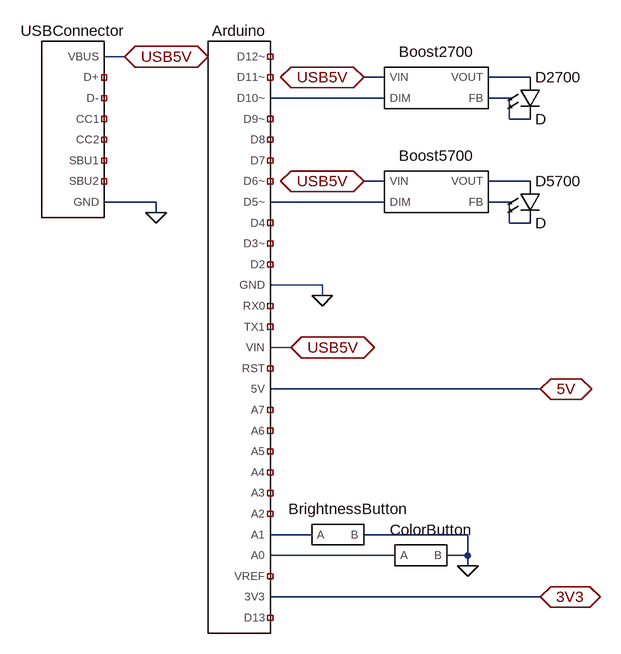
[diagram p0: schematic LEDs.asc]
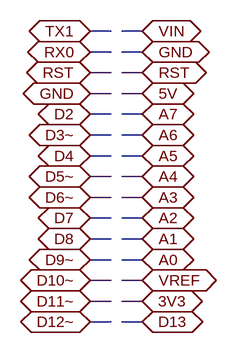
[diagram p1: sub-circuit arduino.asc]
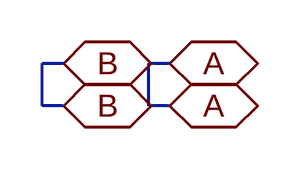
[diagram p2: sub-circuit button.asc]
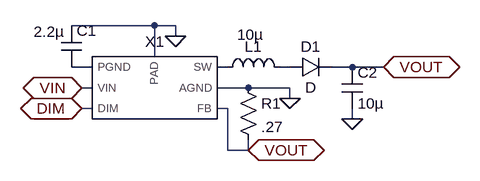
[diagram p3: sub-circuit boost.asc]
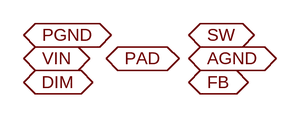
[diagram p4: sub-circuit boostcontroller.asc]
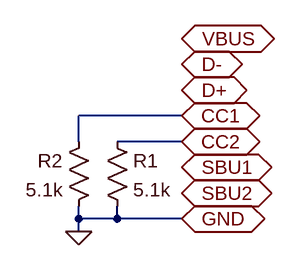
[diagram p5: sub-circuit usbc.asc]
LEDs.asc, the LTspice schematic file:
Version 4
SHEET 1 1184 824
WIRE -192 -112 -224 -112
WIRE 208 -80 176 -80
WIRE 432 -80 368 -80
WIRE 208 -48 32 -48
WIRE 400 -48 368 -48
WIRE 400 -16 400 -48
WIRE 432 -16 400 -16
WIRE 208 80 176 80
WIRE 432 80 368 80
WIRE -144 112 -224 112
WIRE 208 112 32 112
WIRE 400 112 368 112
WIRE -144 128 -144 112
WIRE 400 144 400 112
WIRE 432 144 400 144
WIRE 112 240 32 240
WIRE 112 256 112 240
WIRE 64 336 32 336
WIRE 448 400 32 400
WIRE 96 624 32 624
WIRE 336 624 176 624
WIRE 224 656 32 656
WIRE 336 656 336 624
WIRE 336 656 304 656
WIRE 336 672 336 656
WIRE 448 720 32 720
FLAG 336 672 0
FLAG 112 256 0
FLAG 448 720 3V3
IOPIN 448 720 BiDir
FLAG 448 400 5V
IOPIN 448 400 BiDir
FLAG 176 -80 USB5V
IOPIN 176 -80 BiDir
FLAG 176 80 USB5V
IOPIN 176 80 BiDir
FLAG 64 336 USB5V
IOPIN 64 336 BiDir
FLAG -192 -112 USB5V
IOPIN -192 -112 BiDir
FLAG -144 128 0
SYMBOL FriedRice\\Arduino -16 320 R0
SYMATTR InstName Arduino
SYMBOL FriedRice\\Button 144 640 R0
SYMATTR InstName BrightnessButton
SYMBOL FriedRice\\Button 272 672 R0
SYMATTR InstName ColorButton
SYMBOL FriedRice\\Boost 288 -48 R0
SYMATTR InstName Boost2700
SYMBOL FriedRice\\Boost 288 112 R0
SYMATTR InstName Boost5700
SYMBOL LED 416 -80 R0
SYMATTR InstName D2700
SYMBOL LED 416 80 R0
SYMATTR InstName D5700
SYMBOL FriedRice\\USBC -272 0 R0
SYMATTR InstName USBConnector

arduino.asc, the sub-circuit schematic file:
Version 4
SHEET 1 880 680
WIRE 48 -80 16 -80
WIRE 96 -80 64 -80
WIRE 48 -48 16 -48
WIRE 96 -48 64 -48
WIRE 48 -16 16 -16
WIRE 96 -16 64 -16
WIRE 48 16 16 16
WIRE 96 16 64 16
WIRE 48 48 16 48
WIRE 96 48 64 48
WIRE 48 80 16 80
WIRE 96 80 64 80
WIRE 48 112 16 112
WIRE 96 112 64 112
WIRE 48 144 16 144
WIRE 96 144 64 144
WIRE 48 176 16 176
WIRE 96 176 64 176
WIRE 48 208 16 208
WIRE 96 208 64 208
WIRE 48 240 16 240
WIRE 96 240 64 240
WIRE 48 272 16 272
WIRE 96 272 64 272
WIRE 48 304 16 304
WIRE 96 304 64 304
WIRE 48 336 16 336
WIRE 96 336 64 336
WIRE 48 368 16 368
WIRE 96 368 64 368
FLAG 16 16 GND
IOPIN 16 16 BiDir
FLAG 16 48 D2
IOPIN 16 48 BiDir
FLAG 16 80 D3~
IOPIN 16 80 BiDir
FLAG 16 112 D4
IOPIN 16 112 BiDir
FLAG 16 144 D5~
IOPIN 16 144 BiDir
FLAG 16 176 D6~
IOPIN 16 176 BiDir
FLAG 16 208 D7
IOPIN 16 208 BiDir
FLAG 16 240 D8
IOPIN 16 240 BiDir
FLAG 16 272 D9~
IOPIN 16 272 BiDir
FLAG 16 304 D10~
IOPIN 16 304 BiDir
FLAG 16 -16 RST
IOPIN 16 -16 BiDir
FLAG 16 -48 RX0
IOPIN 16 -48 BiDir
FLAG 16 -80 TX1
IOPIN 16 -80 BiDir
FLAG 16 336 D11~
IOPIN 16 336 BiDir
FLAG 16 368 D12~
IOPIN 16 368 BiDir
FLAG 96 -48 GND
IOPIN 96 -48 BiDir
FLAG 96 48 A7
IOPIN 96 48 BiDir
FLAG 96 80 A6
IOPIN 96 80 BiDir
FLAG 96 112 A5
IOPIN 96 112 BiDir
FLAG 96 144 A4
IOPIN 96 144 BiDir
FLAG 96 176 A3
IOPIN 96 176 BiDir
FLAG 96 208 A2
IOPIN 96 208 BiDir
FLAG 96 240 A1
IOPIN 96 240 BiDir
FLAG 96 272 A0
IOPIN 96 272 BiDir
FLAG 96 304 VREF
IOPIN 96 304 BiDir
FLAG 96 -16 RST
IOPIN 96 -16 BiDir
FLAG 96 16 5V
IOPIN 96 16 BiDir
FLAG 96 -80 VIN
IOPIN 96 -80 BiDir
FLAG 96 336 3V3
IOPIN 96 336 BiDir
FLAG 96 368 D13
IOPIN 96 368 BiDir

button.asc, the sub-circuit schematic file:
Version 4
SHEET 1 880 680
WIRE -32 64 -48 64
WIRE 48 64 32 64
WIRE -48 96 -48 64
WIRE -32 96 -48 96
WIRE 32 96 32 64
WIRE 48 96 32 96
FLAG 48 64 A
IOPIN 48 64 BiDir
FLAG 48 96 A
IOPIN 48 96 BiDir
FLAG -32 96 B
IOPIN -32 96 BiDir
FLAG -32 64 B
IOPIN -32 64 BiDir

boost.asc, the sub-circuit schematic file:
Version 4
SHEET 1 880 680
WIRE 128 112 0 112
WIRE 160 112 128 112
WIRE 160 128 160 112
WIRE 128 160 128 112
WIRE 32 176 0 176
WIRE 240 176 224 176
WIRE 336 176 320 176
WIRE 432 176 400 176
WIRE 480 176 432 176
WIRE 32 208 16 208
WIRE 272 208 224 208
WIRE 336 208 272 208
WIRE 336 224 336 208
WIRE 32 240 16 240
WIRE 240 240 224 240
WIRE 432 256 432 240
WIRE 240 304 240 240
WIRE 272 304 272 288
WIRE 272 304 240 304
FLAG 336 224 0
FLAG 432 256 0
FLAG 160 128 0
FLAG 480 176 VOUT
IOPIN 480 176 BiDir
FLAG 16 240 DIM
IOPIN 16 240 BiDir
FLAG 16 208 VIN
IOPIN 16 208 BiDir
FLAG 272 304 VOUT
IOPIN 272 304 BiDir
SYMBOL cap -16 112 R0
WINDOW 3 -42 9 Left 2
SYMATTR InstName C1
SYMATTR Value 2.2µ
SYMBOL cap 416 176 R0
SYMATTR InstName C2
SYMATTR Value 10µ
SYMBOL res 256 192 R0
SYMATTR InstName R1
SYMATTR Value .27
SYMBOL ind 224 192 R270
WINDOW 0 32 56 VTop 2
WINDOW 3 82 51 VBottom 2
SYMATTR InstName L1
SYMATTR Value 10µ
SYMBOL diode 336 192 R270
WINDOW 0 32 32 VTop 2
WINDOW 3 0 32 VBottom 2
SYMATTR InstName D1
SYMBOL FriedRice\\BoostController 128 272 R0
SYMATTR InstName X1

boostcontroller.asc, the sub-circuit schematic file:
Version 4
SHEET 1 880 680
FLAG 256 112 PGND
IOPIN 256 112 BiDir
FLAG 256 144 VIN
IOPIN 256 144 BiDir
FLAG 256 176 DIM
IOPIN 256 176 BiDir
FLAG 368 144 PAD
IOPIN 368 144 BiDir
FLAG 480 112 SW
IOPIN 480 112 BiDir
FLAG 480 144 AGND
IOPIN 480 144 BiDir
FLAG 480 176 FB
IOPIN 480 176 BiDir

usbc.asc, the sub-circuit schematic file:
Version 4
SHEET 1 880 680
WIRE 64 208 -64 208
WIRE -64 240 -64 208
WIRE 64 240 -16 240
WIRE -64 336 -64 320
WIRE -16 336 -16 320
WIRE -16 336 -64 336
WIRE 64 336 -16 336
WIRE -64 352 -64 336
FLAG 64 112 VBUS
IOPIN 64 112 BiDir
FLAG 64 144 D-
IOPIN 64 144 BiDir
FLAG 64 176 D+
IOPIN 64 176 BiDir
FLAG 64 208 CC1
IOPIN 64 208 BiDir
FLAG 64 240 CC2
IOPIN 64 240 BiDir
FLAG 64 272 SBU1
IOPIN 64 272 BiDir
FLAG 64 304 SBU2
IOPIN 64 304 BiDir
FLAG 64 336 GND
IOPIN 64 336 BiDir
FLAG -64 352 0
SYMBOL res -32 224 R0
SYMATTR InstName R1
SYMATTR Value 5.1k
SYMBOL res -48 224 M0
SYMATTR InstName R2
SYMATTR Value 5.1k

The netlist it stands for:
* LEDs.asc
XArduino NC_01 NC_02 N002 NC_03 NC_04 NC_05 NC_06 N005 NC_07 NC_08 NC_09 0 NC_10 NC_11 USB5V NC_12 5V NC_13 NC_14 NC_15 NC_16 NC_17 NC_18 N007 N008 NC_19 3V3 NC_20 arduino
XBrightnessButton N007 0 button
XColorButton N008 0 button
XBoost2700 N002 USB5V N001 N003 boost
XBoost5700 N005 USB5V N004 N006 boost
D2700 N001 N003 D
D5700 N004 N006 D
XUSBConnector USB5V NC_21 NC_22 NC_23 NC_24 NC_25 NC_26 0 usbc

* block symbol definitions
.subckt arduino D12~ D11~ D10~ D9~ D8 D7 D6~ D5~ D4 D3~ D2 GND RX0 TX1 VIN RST 5V A7 A6 A5 A4 A3 A2 A1 A0 VREF 3V3 D13
.ends arduino

.subckt button A B
.ends button

.subckt boost DIM VIN VOUT FB
C1 0 N001 2.2µ
C2 VOUT 0 10µ
R1 0 VOUT .27
L1 N002 N003 10µ
D1 N003 VOUT D
XX1 N001 VIN DIM VOUT 0 N002 0 boostcontroller
.ends boost

.subckt boostcontroller PGND VIN DIM FB AGND SW PAD
.ends boostcontroller

.subckt usbc VBUS D+ D- CC1 CC2 SBU1 SBU2 GND
R1 CC2 0 5.1k
R2 CC1 0 5.1k
.ends usbc

.model D D
.lib standard.dio
.backanno
.end